# EAGLE schematic synchronizer v1.0 (EAGLE 6.5.0)

## Sheet 1 of 2: SUPPLY
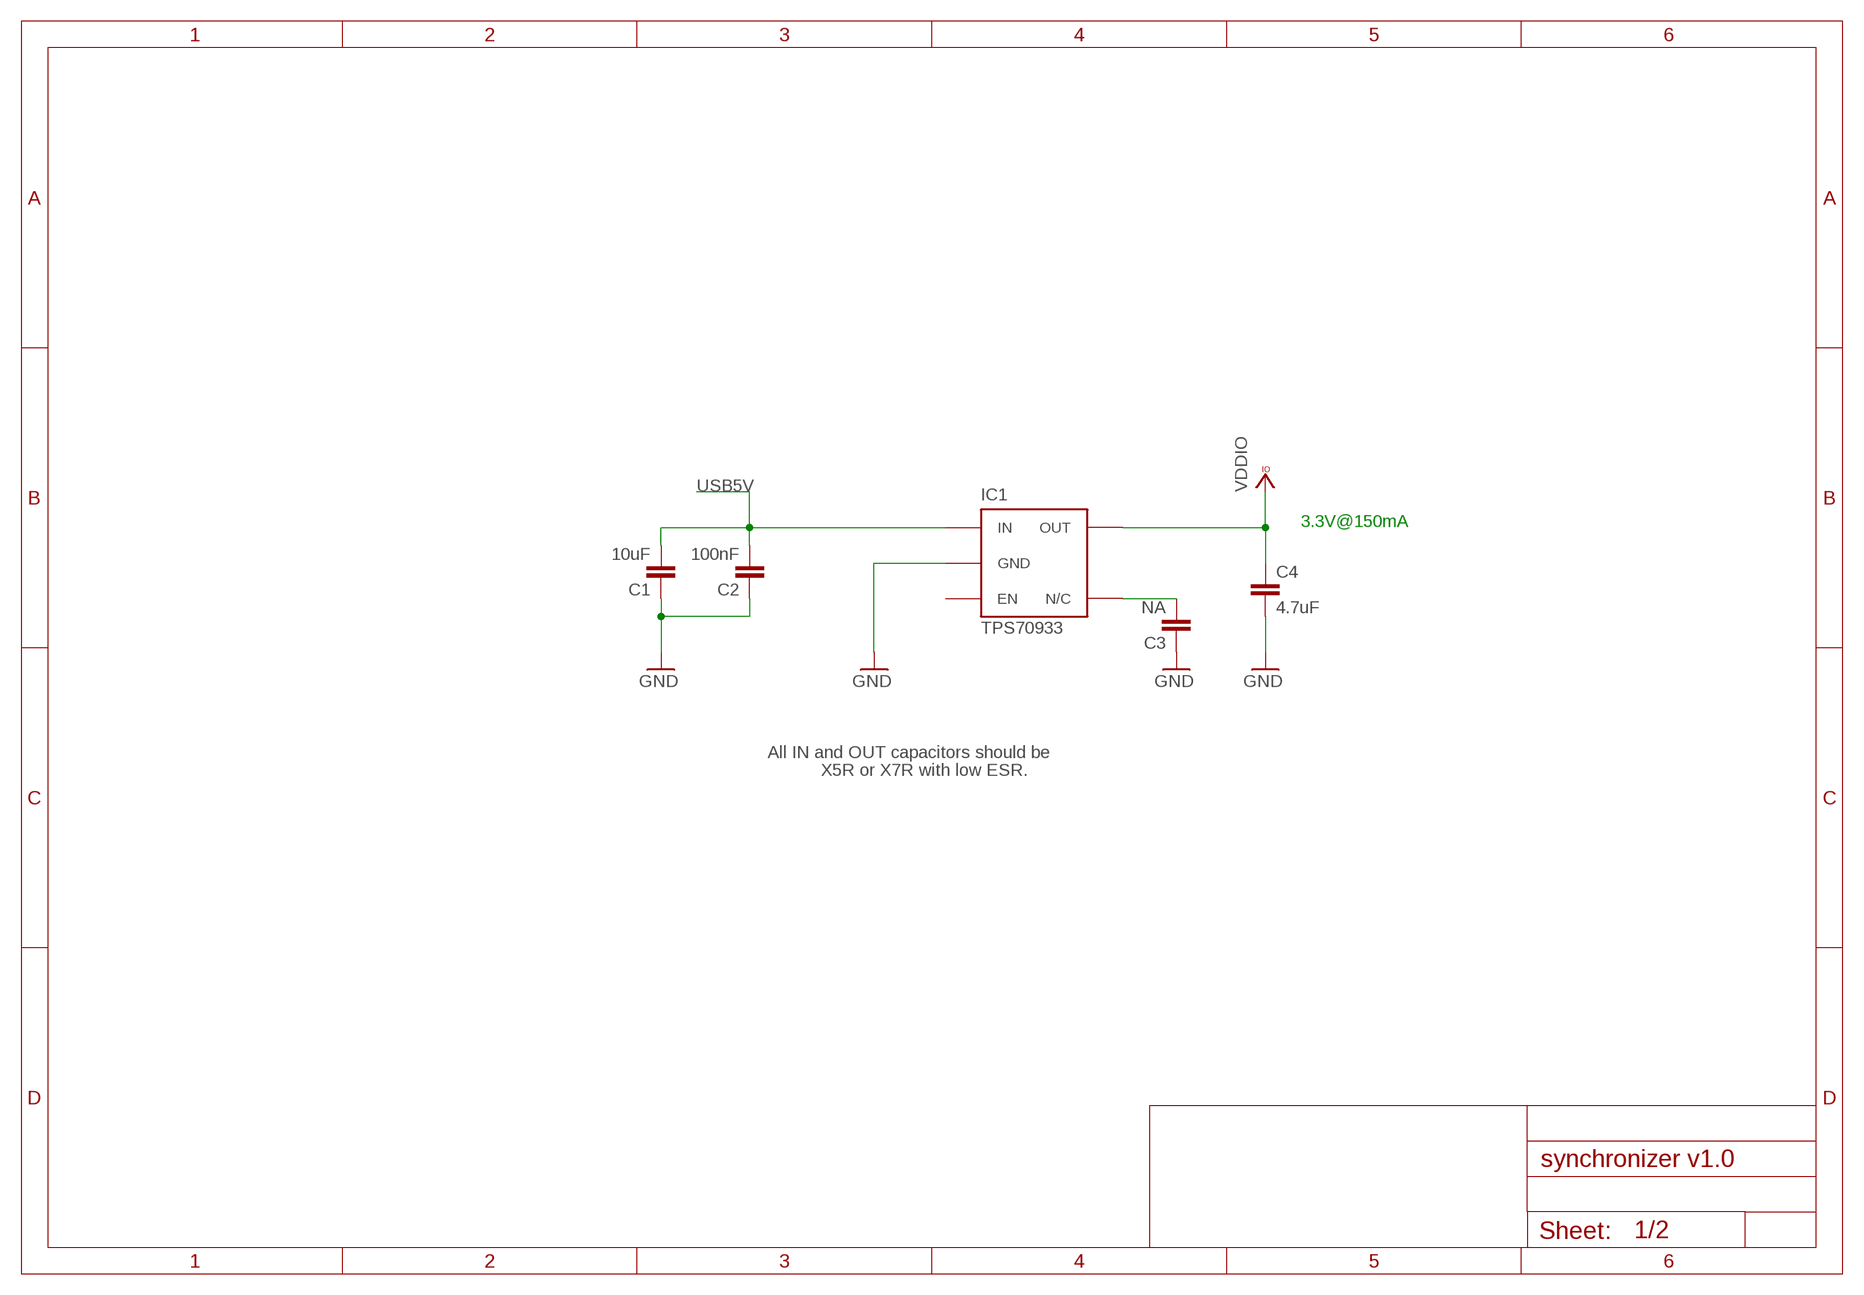
[diagram p0: schematic, sheet 1]

### Parts
C1  10uF  C-EUC0603  [C0603]
C2  100nF  C-EUC0402  [C0402]
C3  NA  C-EUC0402  [C0402]
C4  4.7uF  C-EUC0603  [C0603]
IC1  TPS70933  TLV700XX  [TSOT23-5]

### Nets
GND: C1.1 C2.1 C3.1 C4.2 IC1.2(GND) ; also sheet 2
N$32: C3.2 IC1.4(N/C)
USB5V: C1.2 C2.2 IC1.1(IN) ; also sheet 2
VCCIO: C4.1 IC1.5(OUT) ; supply symbol labelled VDDIO ; also sheet 2
Unconnected: IC1.3(EN)

### Notes on the sheet
- 3.3V@150mA
- All IN and OUT capacitors should be
- X5R or X7R with low ESR.

## Sheet 2 of 2: uC
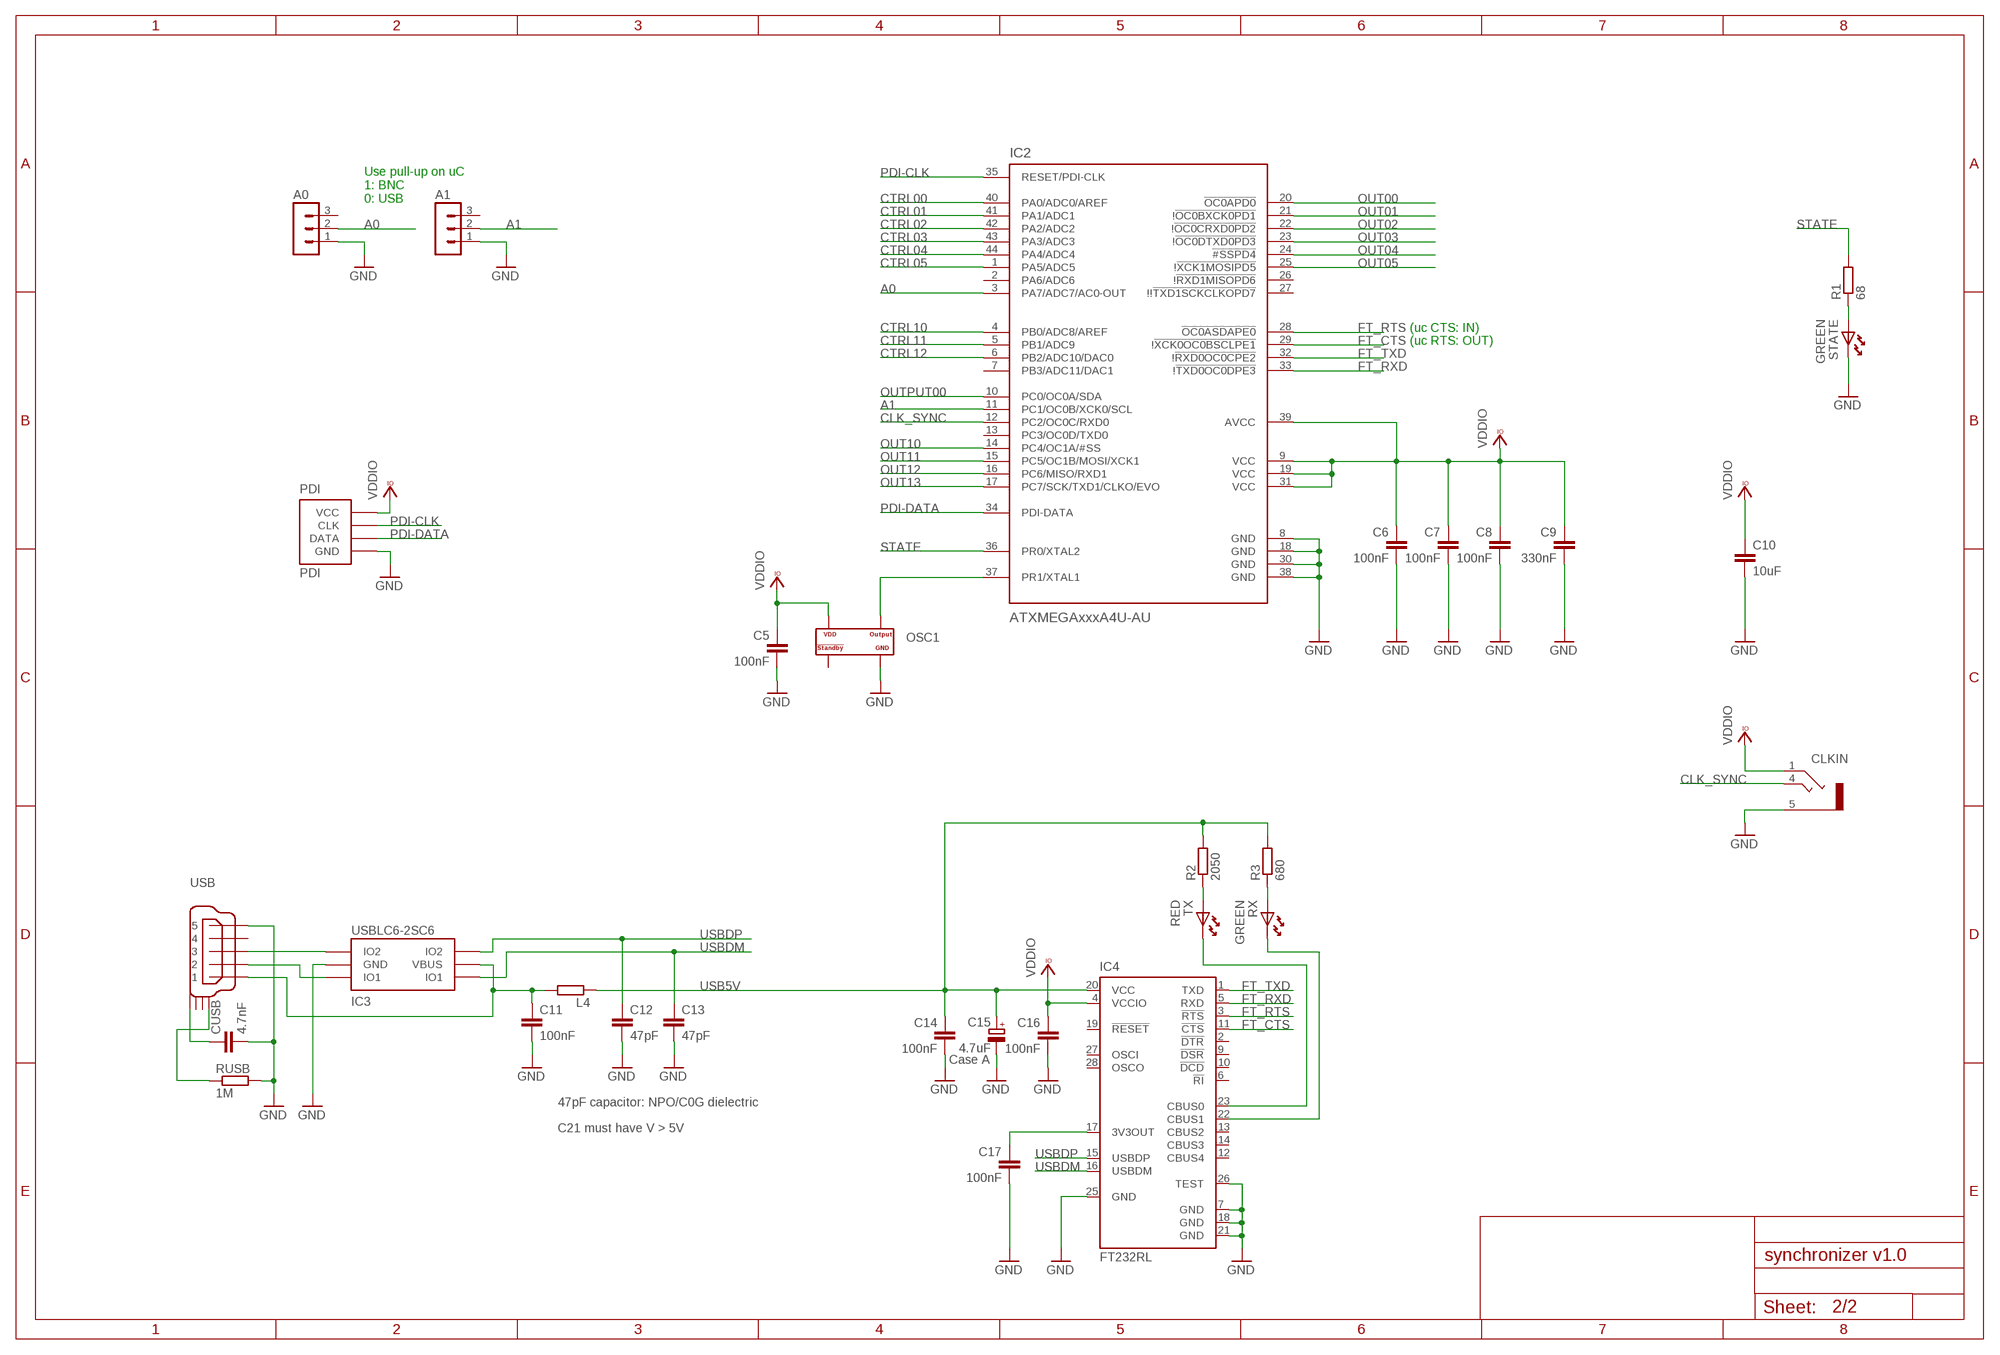
[diagram p1: schematic, sheet 2, part 1 of 2]
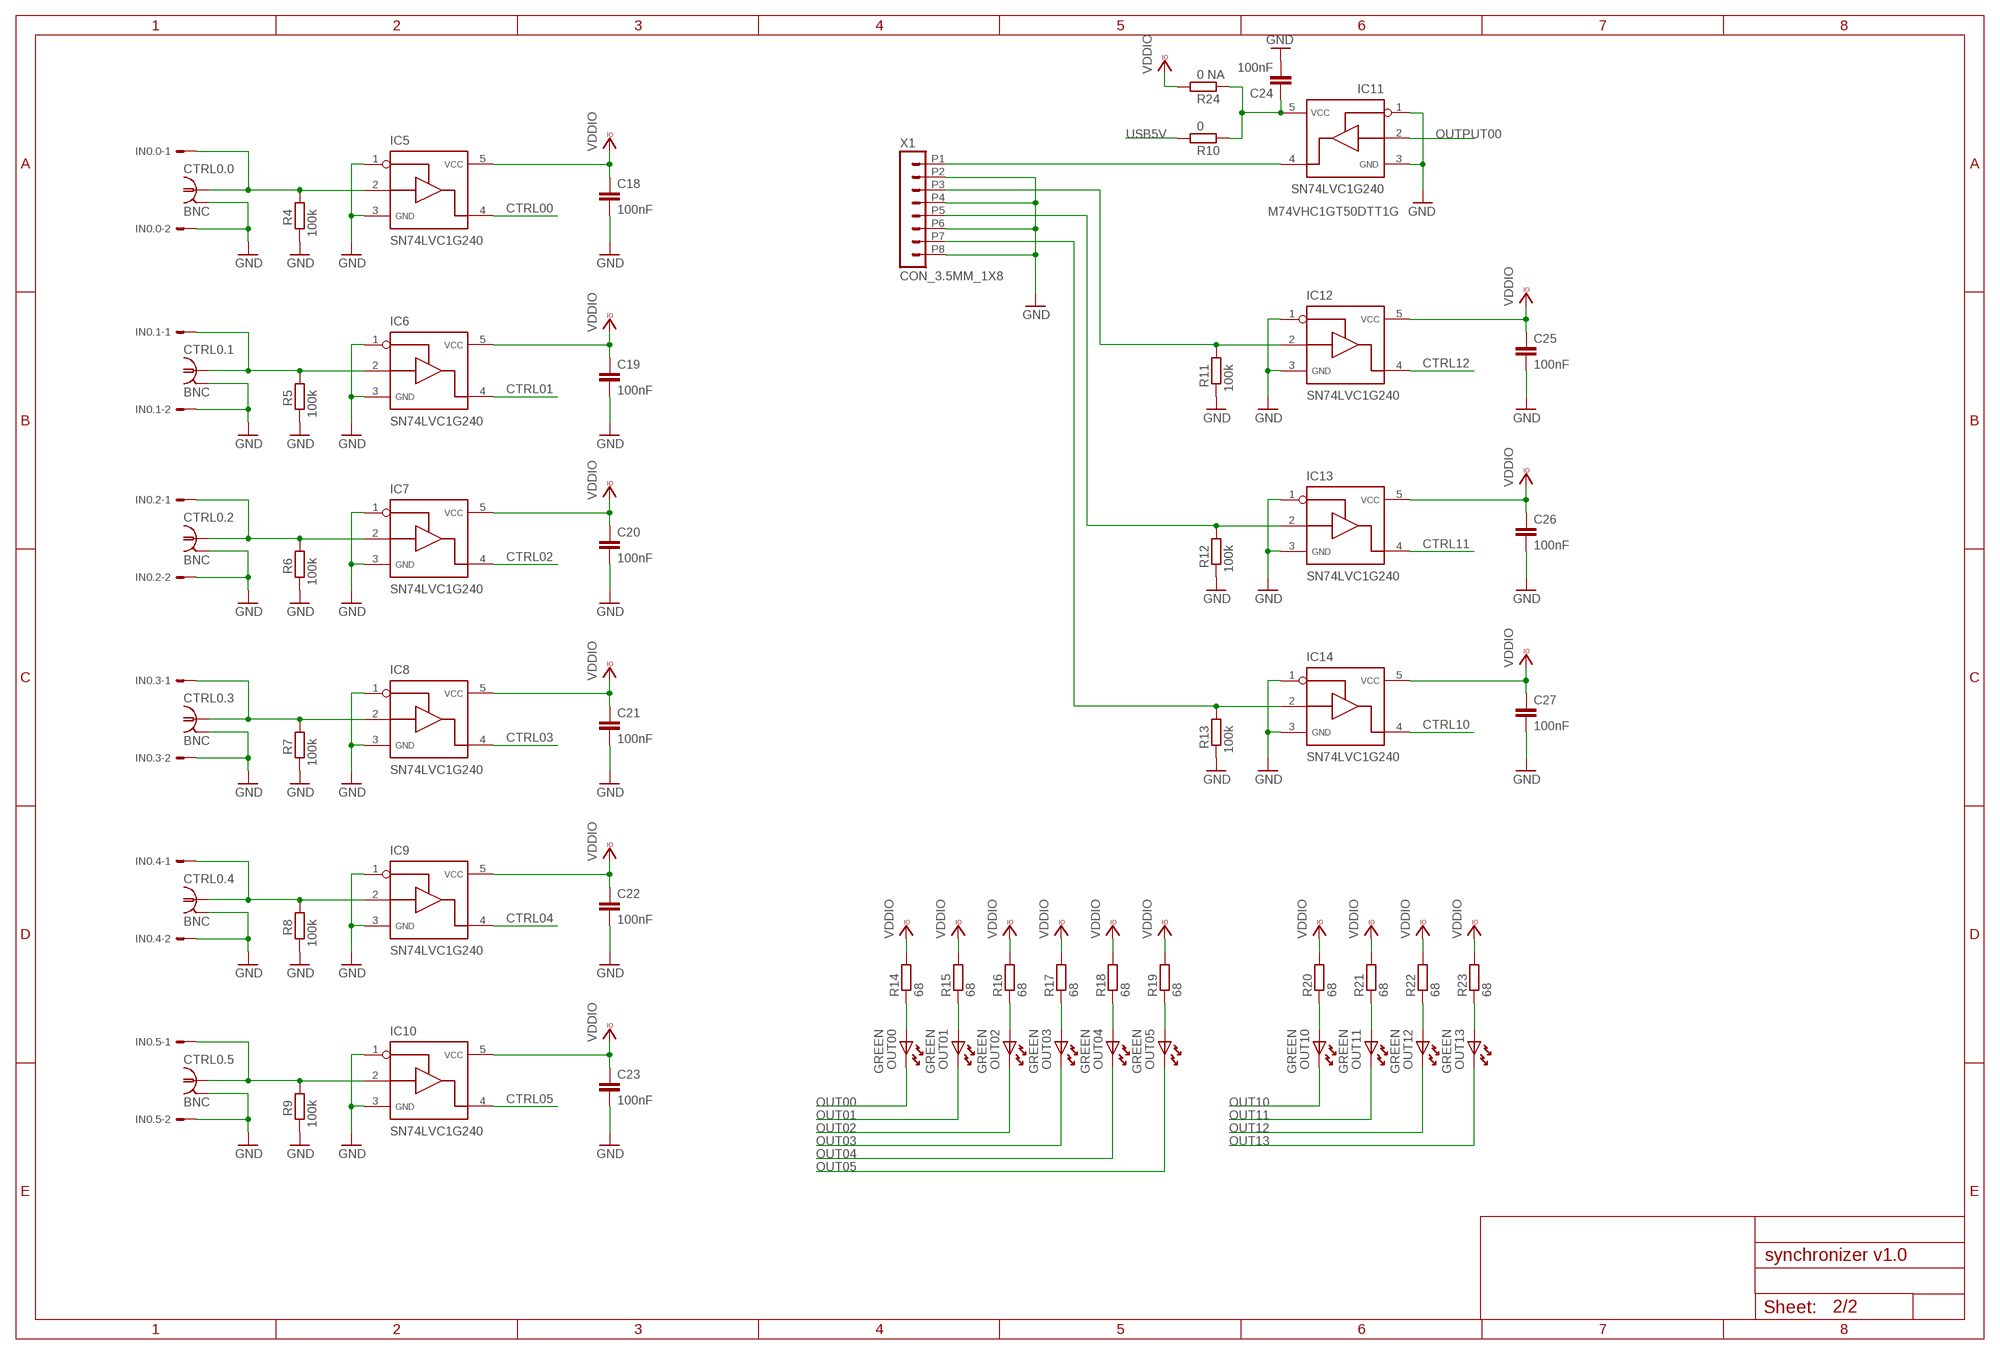
[diagram p2: schematic, sheet 2, part 2 of 2]

### Parts
A0  MA03-1  [MA03-1]
A1  MA03-1  [MA03-1]
C5  100nF  C-EUC0402  [C0402]
C6  100nF  C-EUC0402  [C0402]
C7  100nF  C-EUC0402  [C0402]
C8  100nF  C-EUC0402  [C0402]
C9  330nF  C-EUC0402  [C0402]
C10  10uF  C-EUC0603  [C0603]
C11  100nF  C-EUC0402  [C0402]
C12  47pF  C-EUC0402  [C0402]
C13  47pF  C-EUC0402  [C0402]
C14  100nF  C-EUC0402  [C0402]
C15  4.7uF  CPOL-EUA/3216-18W  [A/3216-18W]
C16  100nF  C-EUC0402  [C0402]
C17  100nF  C-EUC0402  [C0402]
C18  100nF  C-EUC0402  [C0402]
C19  100nF  C-EUC0402  [C0402]
C20  100nF  C-EUC0402  [C0402]
C21  100nF  C-EUC0402  [C0402]
C22  100nF  C-EUC0402  [C0402]
C23  100nF  C-EUC0402  [C0402]
C24  100nF  C-EUC0402  [C0402]
C25  100nF  C-EUC0402  [C0402]
C26  100nF  C-EUC0402  [C0402]
C27  100nF  C-EUC0402  [C0402]
CLKIN  STEREO_JACK  [35RASMT2BHNTRX]
CTRL0.0  BNC  [BNC_RA]
CTRL0.1  BNC  [BNC_RA]
CTRL0.2  BNC  [BNC_RA]
CTRL0.3  BNC  [BNC_RA]
CTRL0.4  BNC  [BNC_RA]
CTRL0.5  BNC  [BNC_RA]
CUSB  4.7nF  C-EUC0402  [C0402]
IC2  ATXMEGAxxxA4U-AU  AT-XMEGA-XXA4-AU  [QFP80P1200X1200X120-44N]
IC3  USBLC6-2SC6  USBLC6-2  [SOT23-6L]
IC4  FT232RL  [SSOP28]
IC5  SN74LVC1G240  SN74LVC1G125  [SOT23-5]
IC6  SN74LVC1G240  SN74LVC1G125  [SOT23-5]
IC7  SN74LVC1G240  SN74LVC1G125  [SOT23-5]
IC8  SN74LVC1G240  SN74LVC1G125  [SOT23-5]
IC9  SN74LVC1G240  SN74LVC1G125  [SOT23-5]
IC10  SN74LVC1G240  SN74LVC1G125  [SOT23-5]
IC11  SN74LVC1G240  SN74LVC1G125  [SOT23-5]
IC12  SN74LVC1G240  SN74LVC1G125  [SOT23-5]
IC13  SN74LVC1G240  SN74LVC1G125  [SOT23-5]
IC14  SN74LVC1G240  SN74LVC1G125  [SOT23-5]
IN0.0  22-05-7028-02  [7395-02]
IN0.1  22-05-7028-02  [7395-02]
IN0.2  22-05-7028-02  [7395-02]
IN0.3  22-05-7028-02  [7395-02]
IN0.4  22-05-7028-02  [7395-02]
IN0.5  22-05-7028-02  [7395-02]
L4  ???  R-EU_R0805  [R0805]
OSC1  OSCILLATOR  [OSCILLATOR_3.2X2.5]
OUT00  GREEN  LEDHAND  [LED_HAND]
OUT01  GREEN  LEDHAND  [LED_HAND]
OUT02  GREEN  LEDHAND  [LED_HAND]
OUT03  GREEN  LEDHAND  [LED_HAND]
OUT04  GREEN  LEDHAND  [LED_HAND]
OUT05  GREEN  LEDHAND  [LED_HAND]
OUT10  GREEN  LEDHAND  [LED_HAND]
OUT11  GREEN  LEDHAND  [LED_HAND]
OUT12  GREEN  LEDHAND  [LED_HAND]
OUT13  GREEN  LEDHAND  [LED_HAND]
PDI  PDI  [PDI_2.54_1X4]
R1  68  R-EU_R0402  [R0402]
R2  2050  R-EU_R0402  [R0402]
R3  680  R-EU_R0402  [R0402]
R4  100k  R-EU_R0402  [R0402]
R5  100k  R-EU_R0402  [R0402]
R6  100k  R-EU_R0402  [R0402]
R7  100k  R-EU_R0402  [R0402]
R8  100k  R-EU_R0402  [R0402]
R9  100k  R-EU_R0402  [R0402]
R10  0  R-EU_R0402  [R0402]
R11  100k  R-EU_R0402  [R0402]
R12  100k  R-EU_R0402  [R0402]
R13  100k  R-EU_R0402  [R0402]
R14  68  R-EU_R0402  [R0402]
R15  68  R-EU_R0402  [R0402]
R16  68  R-EU_R0402  [R0402]
R17  68  R-EU_R0402  [R0402]
R18  68  R-EU_R0402  [R0402]
R19  68  R-EU_R0402  [R0402]
R20  68  R-EU_R0402  [R0402]
R21  68  R-EU_R0402  [R0402]
R22  68  R-EU_R0402  [R0402]
R23  68  R-EU_R0402  [R0402]
R24  0 NA  R-EU_R0402  [R0402]
RUSB  1M  R-EU_R0603  [R0603]
RX  GREEN  LEDHAND  [LED_HAND]
STATE  GREEN  LEDHAND  [LED_HAND]
TX  RED  LEDHAND  [LED_HAND]
USB  USB_MINI_B  [240-0002-1]
X1  CON_3.5MM_1X8  [CON_3.5MM_1X8]

### Nets
A0: A0.2 IC2.3(PA7/ADC7/AC0-OUT)
A1: A1.2 IC2.11(PC1/OC0B/XCK0/SCL)
CLK_SYNC: CLKIN.4 IC2.12(PC2/OC0C/RXD0)
CTRL00: IC2.40(PA0/ADC0/AREF) IC5.4
CTRL01: IC2.41(PA1/ADC1) IC6.4
CTRL02: IC2.42(PA2/ADC2) IC7.4
CTRL03: IC2.43(PA3/ADC3) IC8.4
CTRL04: IC2.44(PA4/ADC4) IC9.4
CTRL05: IC2.1(PA5/ADC5) IC10.4
CTRL10: IC2.4(PB0/ADC8/AREF) IC14.4
CTRL11: IC2.5(PB1/ADC9) IC13.4
CTRL12: IC2.6(PB2/ADC10/DAC0) IC12.4
FT_CTS: IC2.29(!!XCK0OC0BSCLPE1) IC4.11(!CTS)
FT_RTS: IC2.28(!OC0ASDAPE0) IC4.3(!RTS)
FT_RXD: IC2.33(!!TXD0OC0DPE3) IC4.5(RXD)
FT_TXD: IC2.32(!!RXD0OC0CPE2) IC4.1(TXD)
GND: A0.1 A1.1 C5.2 C6.2 C7.2 C8.2 C9.2 C10.2 C11.2 C12.2 C13.2 C14.2 C15.- C16.2 C17.2 C18.2 C19.2 C20.2 C21.2 C22.2 C23.2 C24.2 C25.2 C26.2 C27.2 CLKIN.5 CTRL0.0.2 CTRL0.1.2 CTRL0.2.2 CTRL0.3.2 CTRL0.4.2 CTRL0.5.2 CUSB.2 IC2.8(GND) IC2.18(GND) IC2.30(GND) IC2.38(GND) IC3.P$2(GND) IC4.7(GND) IC4.18(GND) IC4.21(GND) IC4.25(GND) IC4.26(TEST) IC5.1 IC5.3 IC6.1 IC6.3 IC7.1 IC7.3 IC8.1 IC8.3 IC9.1 IC9.3 IC10.1 IC10.3 IC11.1 IC11.3 IC12.1 IC12.3 IC13.1 IC13.3 IC14.1 IC14.3 IN0.0.2 IN0.1.2 IN0.2.2 IN0.3.2 IN0.4.2 IN0.5.2 OSC1.P$2(GND) PDI.P$1(GND) R4.2 R5.2 R6.2 R7.2 R8.2 R9.2 R11.2 R12.2 R13.2 RUSB.2 STATE.K USB.P$5 X1.P2 X1.P4 X1.P6 X1.P8 ; also sheet 1
N$1: CTRL0.1.1 IC6.2 IN0.1.1 R5.1
N$2: CTRL0.2.1 IC7.2 IN0.2.1 R6.1
N$3: CTRL0.3.1 IC8.2 IN0.3.1 R7.1
N$4: IC11.4 X1.P1
N$5: IC12.2 R11.1 X1.P3
N$6: IC13.2 R12.1 X1.P5
N$7: IC14.2 R13.1 X1.P7
N$8: CTRL0.4.1 IC9.2 IN0.4.1 R8.1
N$9: OUT00.A R14.1
N$10: OUT01.A R15.1
N$11: OUT02.A R16.1
N$12: OUT03.A R17.1
N$13: OUT04.A R18.1
N$14: OUT05.A R19.1
N$15: OUT10.A R20.1
N$16: OUT11.A R21.1
N$18: OUT12.A R22.1
N$19: OUT13.A R23.1
N$20: C24.1 IC11.5 R10.2 R24.2
N$22: CTRL0.5.1 IC10.2 IN0.5.1 R9.1
N$23: R1.1 STATE.A
N$26: CTRL0.0.1 IC5.2 IN0.0.1 R4.1
N$38: C17.1 IC4.17(3V3OUT)
N$39: C11.1 IC3.P$5(VBUS) L4.2 USB.P$1
N$40: IC3.P$1(IO1) USB.P$2
N$47: R3.1 RX.A
N$48: IC4.23(CBUS0) TX.K
N$49: IC4.22(CBUS1) RX.K
N$50: IC3.P$3(IO2) USB.P$3
N$59: CUSB.1 USB.SHIELD_4
N$61: RUSB.1 USB.SHIELD_1
N$62: R2.1 TX.A
OSC1: IC2.37(PR1/XTAL1) OSC1.P$3(OUTPUT)
OUT00: IC2.20(!OC0APD0) OUT00.K
OUT01: IC2.21(!!OC0BXCK0PD1) OUT01.K
OUT02: IC2.22(!!OC0CRXD0PD2) OUT02.K
OUT03: IC2.23(!!OC0DTXD0PD3) OUT03.K
OUT04: IC2.24(!#SSPD4) OUT04.K
OUT05: IC2.25(!!XCK1MOSIPD5) OUT05.K
OUT10: IC2.14(PC4/OC1A/#SS) OUT10.K
OUT11: IC2.15(PC5/OC1B/MOSI/XCK1) OUT11.K
OUT12: IC2.16(PC6/MISO/RXD1) OUT12.K
OUT13: IC2.17(PC7/SCK/TXD1/CLKO/EVO) OUT13.K
OUTPUT00: IC2.10(PC0/OC0A/SDA) IC11.2
PDI-CLK: IC2.35(RESET/PDI-CLK) PDI.P$3(CLK)
PDI-DATA: IC2.34(PDI-DATA) PDI.P$2(DATA)
STATE: IC2.36(PR0/XTAL2) R1.2
USB5V: C14.1 C15.+ IC4.20(VCC) L4.1 R2.2 R3.2 R10.1 ; also sheet 1
USBDM: C13.1 IC3.P$6(IO1) IC4.16(USBDM)
USBDP: C12.1 IC3.P$4(IO2) IC4.15(USBDP)
VCCIO: C5.1 C6.1 C7.1 C8.1 C9.1 C10.1 C16.1 C18.1 C19.1 C20.1 C21.1 C22.1 C23.1 C25.1 C26.1 C27.1 CLKIN.1 IC2.9(VCC) IC2.19(VCC) IC2.31(VCC) IC2.39(AVCC) IC4.4(VCCIO) IC5.5 IC6.5 IC7.5 IC8.5 IC9.5 IC10.5 IC12.5 IC13.5 IC14.5 OSC1.P$4(VDD) PDI.P$4(VCC) R14.2 R15.2 R16.2 R17.2 R18.2 R19.2 R20.2 R21.2 R22.2 R23.2 R24.1 ; supply symbol labelled VDDIO ; also sheet 1
Unconnected: A0.3 A1.3 IC2.2(PA6/ADC6) IC2.7(PB3/ADC11/DAC1) IC2.13(PC3/OC0D/TXD0) IC2.26(!!RXD1MISOPD6) IC2.27(!!!TXD1SCKCLKOPD7) IC4.2(!DTR) IC4.6(!RI) IC4.9(!DSR) IC4.10(!DCD) IC4.12(CBUS4) IC4.13(CBUS2) IC4.14(CBUS3) IC4.19(!RESET) IC4.27(OSCI) IC4.28(OSCO) OSC1.P$1(STANDBY#) USB.P$4 USB.SHIELD_2 USB.SHIELD_3

### Notes on the sheet
- Use pull-up on uC
  1: BNC
  0: USB
- M74VHC1GT50DTT1G
- (uc CTS: IN)
- (uc RTS: OUT)
- Case A
- 47pF capacitor: NPO/C0G dielectric
- C21 must have V > 5V

## Library data of the parts
A0 A1 = con-lstb:MA03-1: PIN HEADER; OC_FARNELL: unknown; OC_NEWARK: unknown
C1-C14 C16-C27 CUSB = rcl:C-EU: CAPACITOR, European symbol
C15 = rcl:CPOL-EU: POLARIZED CAPACITOR, European symbol
CLKIN = CNP-connectors:STEREO_JACK
CTRL0.0 CTRL0.1-CTRL0.5 = CNP-connectors:BNC
IC1 = CNP-ics 2:TLV700XX
IC2 = xmega-a4:AT-XMEGA-XXA4-AU: ATxMega a4 Serie
IC3 = CNP 2:USBLC6-2
IC4 = ftdichip:FT232R: Source: http://www.ftdichip.com/Documents/DataSheets/DS_FT232R_v104.pdf; MPN: FT232RL; OC_FARNELL: 1146032; OC_NEWARK: 91K9918
IC5-IC14 = My_library 0v2:SN74LVC1G125
IN0.0 IN0.1-IN0.5 = con-molex:22-?-02: CONNECTOR wire to board 2.54 mm (.1 inch) pitch header; OC_FARNELL: 9731601; OC_NEWARK: unknown
L4 R1-R24 RUSB = rcl:R-EU_: RESISTOR, European symbol
OSC1 = CNP-miscellaneous:OSCILLATOR
OUT00 OUT01-OUT05 OUT10-OUT13 RX STATE TX = CNP-miscellaneous:LED
PDI = CNP-connectors:PDI
USB = CNP-connectors:USB_MINI_B
X1 = CNP-connectors:CON_3.5MM_1X8